# EasyEDA Pro project MasterSword_v1-0.eprj

# Schematic Schematic1
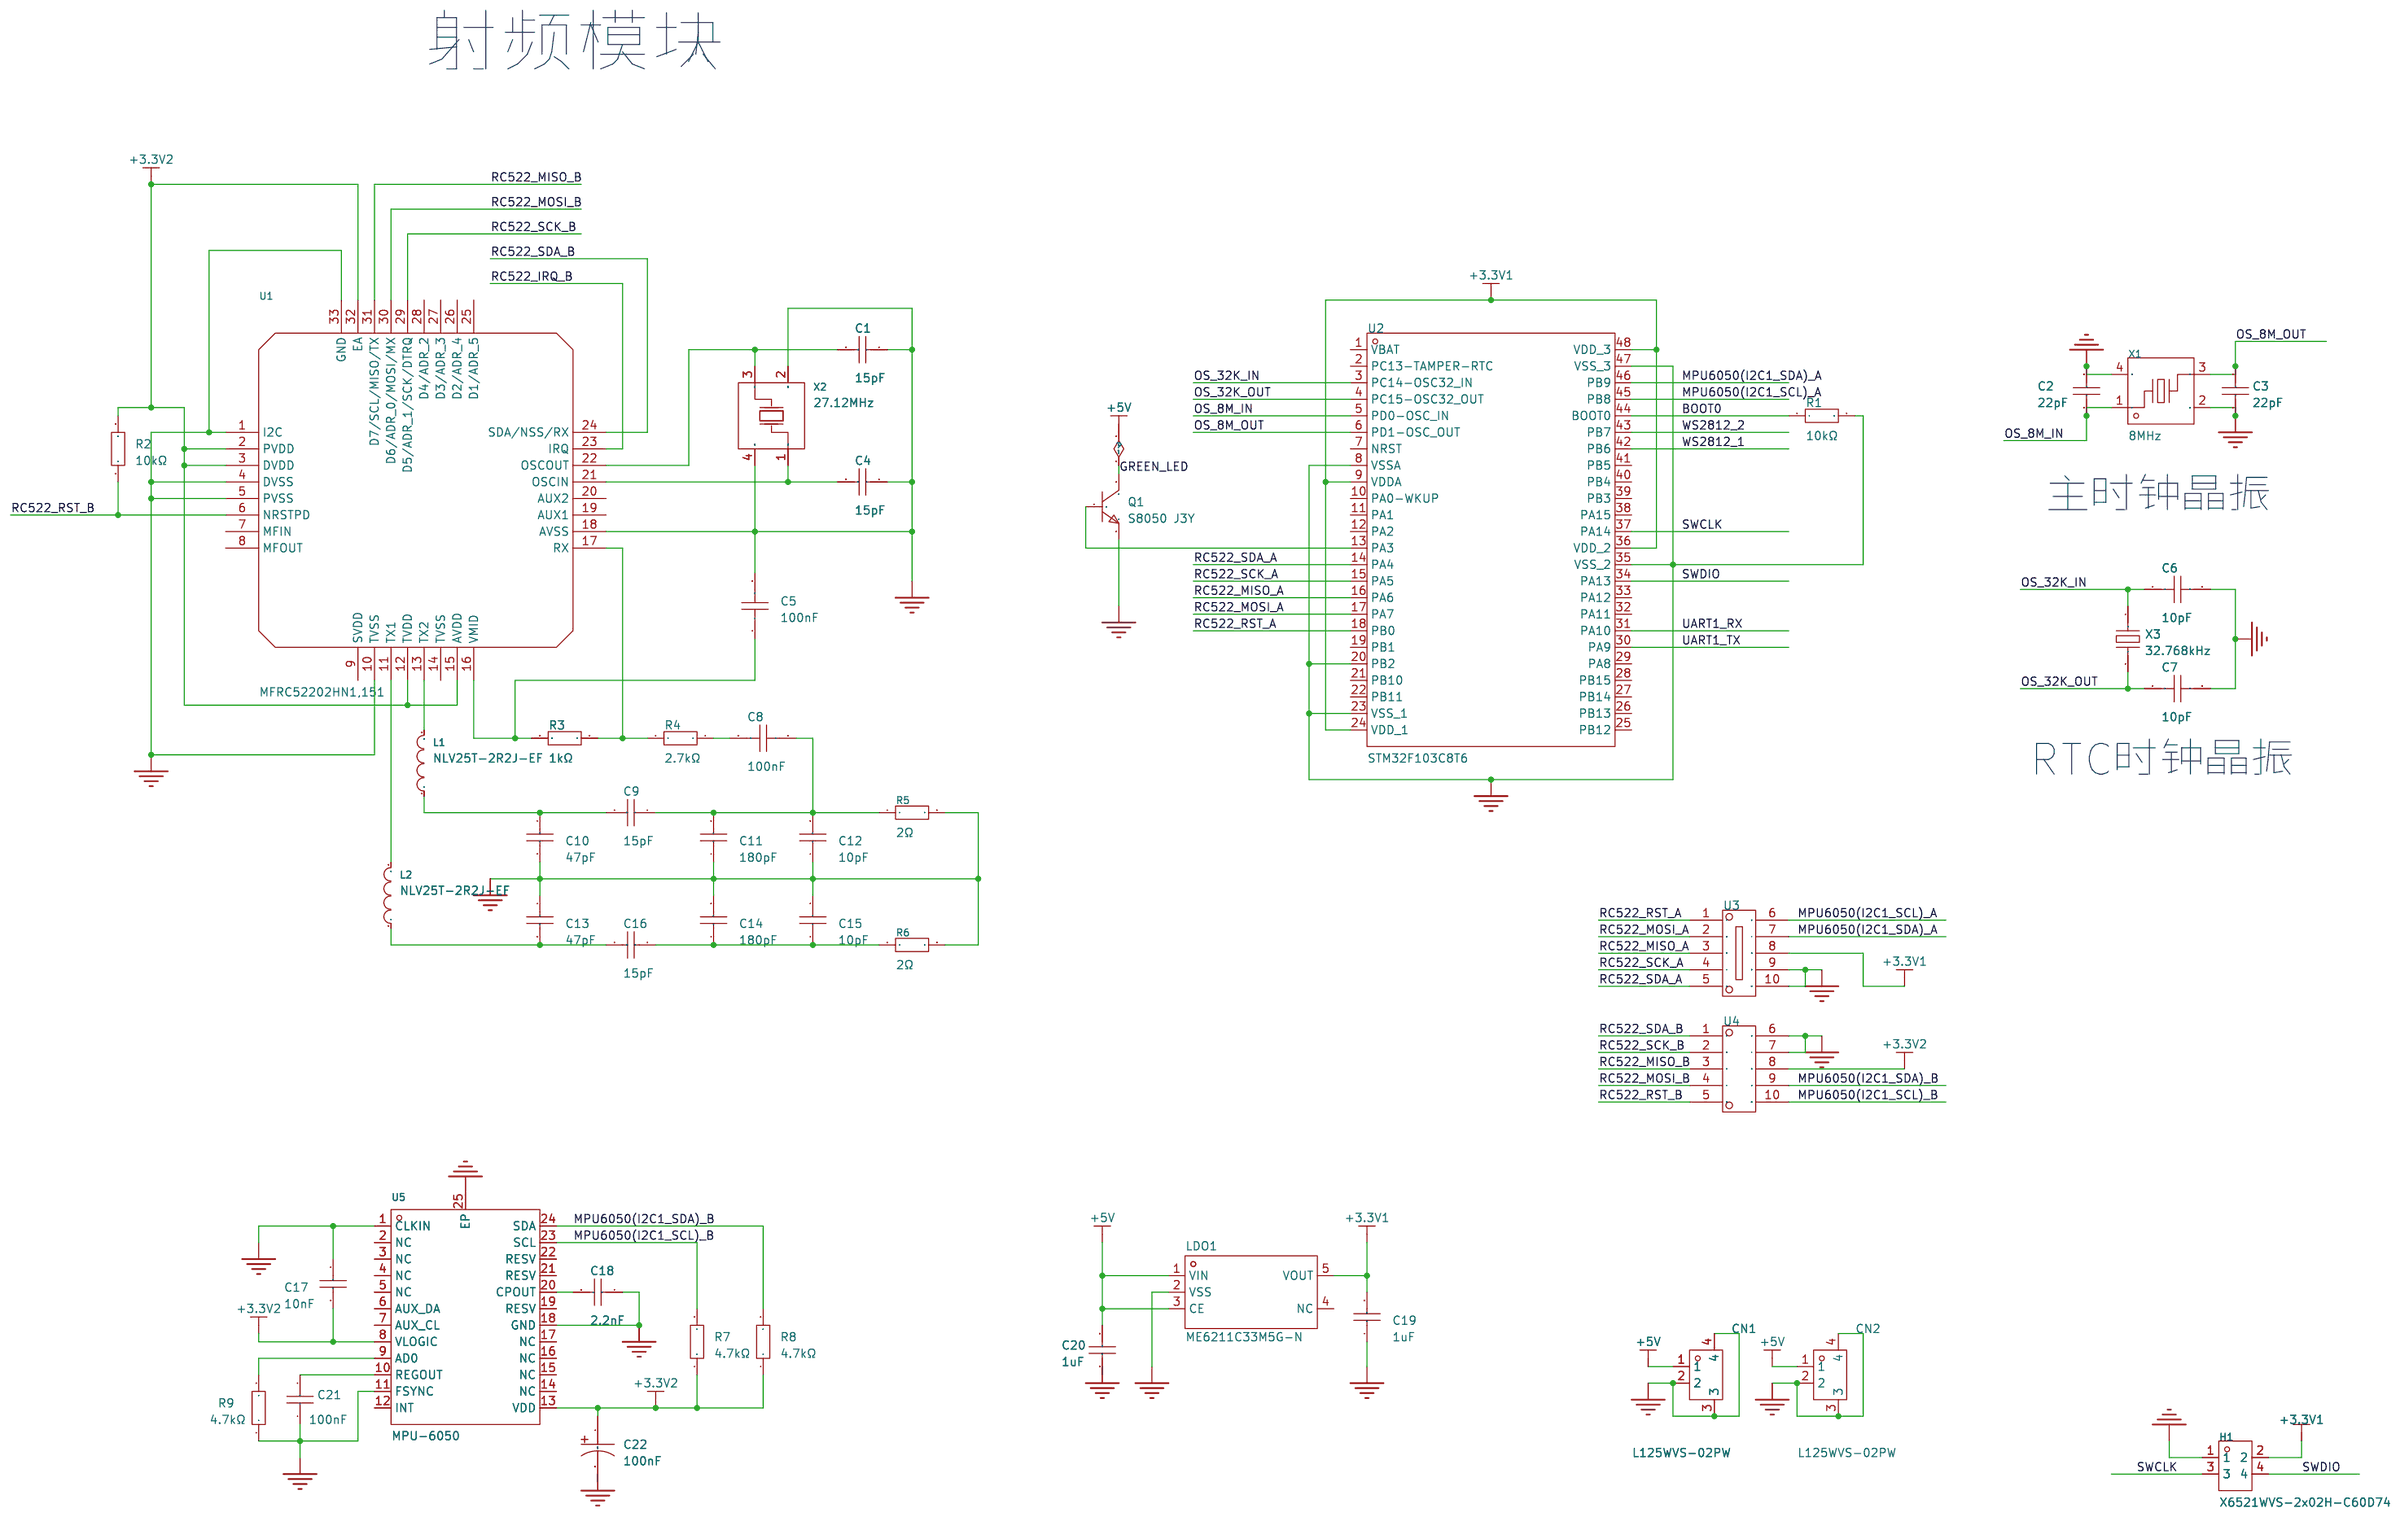
[diagram p0: schematic sheet]

## Parts
C1  15pF  [C0603]
C2  22pF  [C0603]
C3  22pF  [C0603]
C4  15pF  [C0603]
C5  100nF  [C0603]
C6  10pF  [C0603]
C7  10pF  [C0603]
C8  100nF  [C0603]
C9  15pF  [C0603]
C10  47pF  [C0603]
C11  180pF  [C0603]
C12  10pF  [C0603]
C13  47pF  [C0603]
C14  180pF  [C0603]
C15  10pF  [C0603]
C16  15pF  [C0603]
C17  10nF  [C0603]
C18  2.2nF  [C0603]
C19  1uF  [C0603]
C20  1uF  [C0603]
C21  100nF  [C0603]
C22  100nF  [CASE-A_3216]
CN1  L125WVS-02PW  [CONN-SMD_2P-P1.25_DELON_L125WVS-02PW]
CN2  L125WVS-02PW  [CONN-SMD_2P-P1.25_DELON_L125WVS-02PW]
H1  X6521WVS-2x02H-C60D74  [HDR-SMD_4P-P2.54-V-M-R2-C5-S7.4]
L1  NLV25T-2R2J-EF  [IND-SMD_L2.5-W2.0_NLV25T-390J-PF]
L2  NLV25T-2R2J-EF  [IND-SMD_L2.5-W2.0_NLV25T-390J-PF]
LDO1  ME6211C33M5G-N  [SOT-23-5_L3.0-W1.7-P0.95-LS2.8-BL]
Q1  S8050 J3Y  [SOT-23-3_L3.0-W1.7-P0.95-LS2.9-BR]
R1  10kΩ  [R0603]
R2  10kΩ  [R0603]
R3  1kΩ  [R0603]
R4  2.7kΩ  [R0603]
R5  2Ω  [R0603]
R6  2Ω  [R0603]
R7  4.7kΩ  [R0603]
R8  4.7kΩ  [R0603]
R9  4.7kΩ  [R0603]
U1  MFRC52202HN1,151  [QFN-32_L5.0-W5.0-P0.50-BL-EP3.4]
U2  STM32F103C8T6  [LQFP-48_L7.0-W7.0-P0.50-LS9.0-BL]
U3  -  [板对板双槽连接-母-10P]
U4  -  [板对板双槽连接-公-10P]
U5  MPU-6050  [QFN-24_L4.0-W4.0-P0.50-BL-EP2.7]
X1  8MHz  [OSC-SMD_4P-L3.2-W2.5-BL]
X2  27.12MHz  [CRYSTAL-SMD_4P-L3.2-W2.5-BL]
X3  32.768kHz  [OSC-SMD_L3.2-W1.5]

## Library data of the parts
C1 C4 C9 C16 = CC0603JRNPO9BN150: 容值:15pF;精度:±5%;额定电压:50V;材质(温度系数):NP0;; LCSC Part Name: 15pF ±5% 50V; Supplier Part: C107037; Manufacturer: YAGEO(国巨); Supplier Footprint: 0603; JLCPCB Part Class: 扩展库; Datasheet: https://atta.szlcsc.com/upload/public/pdf/source/20170420/1492670688140.pdf; Supplier: LCSC; Tolerance: ±5%; Voltage Rated: 50V; Temperature Coefficient: NP0
C2 C3 = CL10C220JB8NNNC: 容值:22pF;精度:±5%;额定电压:50V;材质(温度系数):C0G;; LCSC Part Name: 22pF ±5% 50V; Supplier Part: C1653; Manufacturer: SAMSUNG(三星); Supplier Footprint: 0603; JLCPCB Part Class: 基础库; Datasheet: https://atta.szlcsc.com/upload/public/pdf/source/20160103/1457707687317.pdf; Supplier: LCSC; Tolerance: ±5%; Voltage Rated: 50V; Temperature Coefficient: C0G
C5 C8 = CC0603KRX7R9BB104: 容值:100nF;精度:±10%;额定电压:50V;材质(温度系数):X7R;; LCSC Part Name: 100nF ±10% 50V; Supplier Part: C14663; Manufacturer: YAGEO(国巨); Supplier Footprint: 0603; JLCPCB Part Class: 基础库; Datasheet: https://atta.szlcsc.com/upload/public/pdf/source/20180910/C282072_33301C7F631E79921B82A8DAC6BCC5B3.pdf; Supplier: LCSC; Tolerance: ±10%; Voltage Rated: 50V; Temperature Coefficient: X7R
C6 C7 = 0603CG100J500NT: 容值:10pF;精度:±5%;额定电压:50V;材质(温度系数):C0G;; LCSC Part Name: 10pF ±5% 50V; Supplier Part: C91367; Manufacturer: FH(风华); Supplier Footprint: 0603; JLCPCB Part Class: 扩展库; Datasheet: https://atta.szlcsc.com/upload/public/pdf/source/20170923/C91367_1506149565935988975.pdf; Supplier: LCSC; Tolerance: ±5%; Voltage Rated: 50V; Temperature Coefficient: C0G
C10 C13 = CC0603JRNPO9BN470: 容值:47pF;精度:±5%;额定电压:50V;材质(温度系数):NP0;; LCSC Part Name: 47pF ±5% 50V; Supplier Part: C105622; Manufacturer: YAGEO(国巨); Supplier Footprint: 0603; JLCPCB Part Class: 扩展库; Datasheet: https://atta.szlcsc.com/upload/public/pdf/source/20170425/1493115772416.pdf; Supplier: LCSC; Tolerance: ±5%; Voltage Rated: 50V; Temperature Coefficient: NP0
C11 C14 = CC0603JRNPO9BN181: 容值:180pF;精度:±5%;额定电压:50V;材质(温度系数):NP0;; LCSC Part Name: 180pF ±5% 50V; Supplier Part: C107041; Manufacturer: YAGEO(国巨); Supplier Footprint: 0603; JLCPCB Part Class: 扩展库; Datasheet: https://atta.szlcsc.com/upload/public/pdf/source/20170420/1492670690406.pdf; Supplier: LCSC; Tolerance: ±5%; Voltage Rated: 50V; Temperature Coefficient: NP0
C12 C15 = CC0603JRNPO9BN100: 容值:10pF;精度:±5%;额定电压:50V;材质(温度系数):NP0;; LCSC Part Name: 10pF ±5% 50V; Supplier Part: C106245; Manufacturer: YAGEO(国巨); Supplier Footprint: 0603; JLCPCB Part Class: 扩展库; Datasheet: https://atta.szlcsc.com/upload/public/pdf/source/20170505/1493957837406.pdf; Supplier: LCSC; Tolerance: ±5%; Voltage Rated: 50V; Temperature Coefficient: NP0
C17 = CC0603KRX7R9BB103: 容值:10nF;精度:±10%;额定电压:50V;材质(温度系数):X7R;; LCSC Part Name: 10nF ±10% 50V; Supplier Part: C100042; Manufacturer: YAGEO(国巨); Supplier Footprint: 0603; JLCPCB Part Class: Extended Part; Datasheet: https://atta.szlcsc.com/upload/public/pdf/source/20180326/C100042_E8B0111D51DE3671A0A4A59FBCEFE81C.pdf; Supplier: LCSC; Tolerance: ±10%; Voltage Rated: 50V; Temperature Coefficient: X7R
C18 = 0603B222K500NT: 温度系数:X7R;容值:2.2nF;精度:±10%;额定电压:50V;; LCSC Part Name: 2.2nF(222) ±10% 50V; Supplier Part: C1604; Manufacturer: FH(风华); Supplier Footprint: 0603; JLCPCB Part Class: Basic Part; Datasheet: https://atta.szlcsc.com/upload/public/pdf/source/20170923/C1604_1506149289438988405.pdf; Supplier: LCSC; Temperature Coefficient: X7R; Tolerance: ±10%; Voltage Rated: 50V
C19 C20 = 0603B105K250NT: 容值:1uF;精度:±10%;额定电压:25V;材质(温度系数):X7R;; LCSC Part Name: 1uF ±10% 25V; Supplier Part: C59302; Manufacturer: FH(风华); Supplier Footprint: 0603; JLCPCB Part Class: 扩展库; Datasheet: https://atta.szlcsc.com/upload/public/pdf/source/20170923/C59302_1506149498957988854.pdf; Supplier: LCSC; Tolerance: ±10%; Voltage Rated: 25V; Temperature Coefficient: X7R
C21 = 0603B104K500NT: 容值:100nF;精度:±10%;额定电压:50V;材质(温度系数):X7R;; LCSC Part Name: 100nF ±10% 50V; Supplier Part: C30926; Manufacturer: FH(风华); Supplier Footprint: 0603; JLCPCB Part Class: 扩展库; Datasheet: https://atta.szlcsc.com/upload/public/pdf/source/20170923/C30926_1506149436298988724.pdf; Supplier: LCSC; Tolerance: ±10%; Voltage Rated: 50V; Temperature Coefficient: X7R
C22 = T491A104K035AT: 容值:100nF;精度:±10%;额定电压:35V;等效串联电阻:20Ω@100kHz;工作温度:-55℃~+125℃;; LCSC Part Name: 100nF ±10% 35V; Supplier Part: C122257; Manufacturer: KEMET(基美); JLCPCB Part Class: Extended Part; Datasheet: https://atta.szlcsc.com/upload/public/pdf/source/20170719/C122257_1500457815021828480.pdf; Supplier: LCSC; Tolerance: ±10%; Rated Voltage: 35V; Equivalent Series Resistance(ESR): 20Ω@100kHz; Operating Temperature: -55℃~+125℃
CN1 CN2 = L125WVS-02PW: 插针结构:1x2P;间距:1.25mm;安装方式:卧贴;总PIN数:2P;排数:1;每排PIN数:2;额定电流:1A;工作温度范围:-40℃~+110℃;; LCSC Part Name: 1x2P 间距:1.25mm 卧贴 GH1.25间距卧式贴片 2P 连接器; Supplier Part: C2998790; Manufacturer: DEALON(德艺隆); Supplier Footprint: SMD,P=1.25mm,卧贴; JLCPCB Part Class: 扩展库; Datasheet: https://atta.szlcsc.com/upload/public/pdf/source/20220425/50B09E6409C3A2782C6D65104D18E34A.pdf; Supplier: LCSC; Pins Structure: 1x2P; Pitch: 1.25mm; Mounting Style: 卧贴; Number of Pins: 2P; Number of Rows: 1; Number of PINs Per Row: 2; Current Rating (Max): 1A; Operating Temperature Range: -40℃~+110℃
H1 = X6521WVS-2x02H-C60D74: 间距:2.54mm;总PIN位数:4;排数:2;插针结构:2x2P;行距:2.54mm;安装类型:立贴;圆针/方针:方针;额定电流:3A;额定电压:250V;配合针长度:6mm;塑高:2.5mm;端接针长度:-;触头材质:黄铜;触头镀层:金;工作温度范围:-40℃~+105℃;焊接温度(最大值):260℃;颜色:黑色;; LCSC Part Name: 2.54mm 2x2P; Supplier Part: C780055; Manufacturer: XKB Connectivity(中国星坤); Supplier Footprint: SMD,P=2.54mm; JLCPCB Part Class: 扩展库; Supplier: LCSC; Pitch: 2.54mm; Number of Pins: 4; Number of Rows: 2; Pin Structure: 2x2P; Row Spacing: 2.54mm; Mounting Type: 立贴; Circluar Pins/Square Pins: 方针; Current Rating (Max): 3A; Voltage Rating (Max): 250V; Length of Mating Pin: 6mm; Insulation Height: 2.5mm; Contact Material: 黄铜; Contact Plating: 金; Operating Temperature Range: -40℃~+105℃; Welding Temperature (Max): 260℃; Color: 黑色
L1 L2 = NLV25T-2R2J-EF: LCSC Part Name: 2.2uH ±5%; Supplier Part: C286744; Manufacturer: TDK; Supplier Footprint: 1008; JLCPCB Part Class: 扩展库; Datasheet: https://atta.szlcsc.com/upload/public/pdf/source/20181106/C295188_2AED5BF284B1398395DA5D724136EAB4.pdf; Supplier: LCSC
LDO1 = ME6211C33M5G-N: 输出类型:固定;输出极性:正;最大输入电压:6V;输出电压:3.3V;输出电流:500mA;电源纹波抑制比(PSRR):70dB;; Supplier Part: C82942; Manufacturer: MICRONE(南京微盟); Supplier Footprint: SOT-23-5; JLCPCB Part Class: 扩展库; Datasheet: https://atta.szlcsc.com/upload/public/pdf/source/20170918/C82942_1505727073070976520.pdf; Supplier: LCSC; Output Type: 固定; Output Polarity: 正; Number of Outputs: 1; Maximum Input Voltage: 6V; Output Voltage: 3.3V; Dropout Voltage: 260mV@(200mA); Output Current: 500mA; Power Supply Rejection Ratio (PSRR): 70dB
Q1 = S8050 J3Y_C2146: 晶体管类型:NPN;集电极电流(Ic):500mA;集射极击穿电压(Vceo):25V;功率(Pd):300mW;直流电流增益(hFE@Ic,Vce):200@50mA,1V;; LCSC Part Name: NPN 电流:500mA 耐压:25V H档(200-350); Supplier Part: C2146; Manufacturer: CJ(江苏长电/长晶); Supplier Footprint: SOT-23; JLCPCB Part Class: 基础库; Datasheet: https://atta.szlcsc.com/upload/public/pdf/source/20140809/1457707209234.pdf; Supplier: LCSC; Transistor Type: NPN; Collector Current (Ic): 500mA; Collector-Emitter Breakdown Voltage (Vceo): 25V; Power Dissipation (Pd): 300mW; DC Current Gain (hFE@Ic,Vce): 200@50mA,1V; Transition Frequency (fT): 150MHz; Collector Cut-Off Current (Icbo): 100nA; Collector-Emitter Saturation Voltage (VCE(sat)@Ic,Ib): 600mV@500mA,50mA
R1 R2 = 0603WAF1002T5E: 电阻类型:厚膜电阻;阻值:10kΩ;精度:±1%;功率:100mW;; LCSC Part Name: 厚膜电阻 10kΩ ±1% 100mW; Supplier Part: C25804; Manufacturer: UNI-ROYAL(厚声); Supplier Footprint: 0603; JLCPCB Part Class: 基础库; Datasheet: https://atta.szlcsc.com/upload/public/pdf/source/20200306/C422600_1E6D84923E4A46A82E41ADD87F860B5C.pdf; Supplier: LCSC; Type: 厚膜电阻; Tolerance: ±1%; Power(Watts): 100mW; Temperature Coefficient: ±100ppm/℃; Overload Voltage (Max): 75V; Operating Temperature Range: -55℃~+155℃
R3 = 0603WAF1001T5E: 电阻类型:厚膜电阻;阻值:1kΩ;精度:±1%;功率:100mW;温度系数:±100ppm/℃;; LCSC Part Name: 厚膜电阻 1kΩ ±1% 100mW; Supplier Part: C21190; Manufacturer: UNI-ROYAL(厚声); Supplier Footprint: 0603; JLCPCB Part Class: Basic Part; Datasheet: https://atta.szlcsc.com/upload/public/pdf/source/20200306/C422600_1E6D84923E4A46A82E41ADD87F860B5C.pdf; Supplier: LCSC; Type: 厚膜电阻; Tolerance: ±1%; Power(Watts): 100mW; Temperature Coefficient: ±100ppm/℃; Overload Voltage (Max): 75V; Operating Temperature Range: -55℃~+155℃
R4 = 0603WAF2701T5E: 电阻类型:厚膜电阻;阻值:2.7kΩ;精度:±1%;功率:100mW;; LCSC Part Name: 2.7kΩ ±1% 100mW; Supplier Part: C13167; Manufacturer: UNI-ROYAL(厚声); Supplier Footprint: 0603; JLCPCB Part Class: Basic Part; Datasheet: https://atta.szlcsc.com/upload/public/pdf/source/20200306/C422600_1E6D84923E4A46A82E41ADD87F860B5C.pdf; Supplier: LCSC; Type: 厚膜电阻; Tolerance: ±1%; Power(Watts): 100mW; Temperature Coefficient: ±100ppm/℃; Overload Voltage (Max): 75V; Operating Temperature Range: -55℃~+155℃
R5 R6 = 0603WAF200KT5E: 电阻类型:厚膜电阻;阻值:2Ω;精度:±1%;功率:100mW;温度系数:±200ppm/℃;; LCSC Part Name: 厚膜电阻 2Ω ±1% 100mW; Supplier Part: C22977; Manufacturer: UNI-ROYAL(厚声); Supplier Footprint: 0603; JLCPCB Part Class: Basic Part; Datasheet: https://atta.szlcsc.com/upload/public/pdf/source/20200306/C422600_1E6D84923E4A46A82E41ADD87F860B5C.pdf; Supplier: LCSC; Type: 厚膜电阻; Tolerance: ±1%; Power(Watts): 100mW; Temperature Coefficient: ±200ppm/℃; Overload Voltage (Max): 75V; Operating Temperature Range: -55℃~+155℃
R7-R9 = 0603WAF4701T5E: 电阻类型:厚膜电阻;阻值:4.7kΩ;精度:±1%;功率:100mW;; LCSC Part Name: 4.7kΩ ±1% 100mW; Supplier Part: C23162; Manufacturer: UNI-ROYAL(厚声); Supplier Footprint: 0603; JLCPCB Part Class: 基础库; Datasheet: https://atta.szlcsc.com/upload/public/pdf/source/20200306/C422600_1E6D84923E4A46A82E41ADD87F860B5C.pdf; Supplier: LCSC; Type: 厚膜电阻; Tolerance: ±1%; Power(Watts): 100mW; Temperature Coefficient: ±100ppm/℃; Overload Voltage (Max): 75V; Operating Temperature Range: -55℃~+155℃
U1 = MFRC52202HN1,151: LCSC Part Name: 高度集成读写IC 用于13.56MHz非接触通信; Supplier Part: C11322; Manufacturer: NXP(恩智浦); Supplier Footprint: QFN-32-EP(5x5); JLCPCB Part Class: Extended Part; Datasheet: https://atta.szlcsc.com/upload/public/pdf/source/20140614/1457707090267.pdf; Supplier: LCSC
U2 = STM32F103C8T6: CPU内核:ARM Cortex-M3;CPU最大主频:72MHz;工作电压范围:2V~3.6V;程序存储容量:64KB;程序存储器类型:FLASH;RAM总容量:20KB;GPIO端口数量:37;; LCSC Part Name: STM32F103C8T6 MSL=3; Supplier Part: C8734; Manufacturer: ST(意法半导体); Supplier Footprint: LQFP-48(7x7); JLCPCB Part Class: 扩展库; Datasheet: https://atta.szlcsc.com/upload/public/pdf/source/20220812/8363ACEC51AD55ECEB84799464F7CB85.pdf; Supplier: LCSC; CPU Core: ARM Cortex-M3; CPU Maximum Speed: 72MHz; Operating Voltage Range: 2V~3.6V; Program Storage Size: 64KB; Program Memory Type: FLASH; RAM Size: 20KB; GPIO Ports Number: 37; ADC (Bit): 12bit; Universal Serial Bus: 有; Peripheral/Function: 看门狗；DMA；看门狗；片载温度传感器; Watchdog: 有; Infrared Data Association: 有; Low-Voltage Detect: 有; Direct Memory Access: 有; Internal Oscillator: 有; Operating Temperature Range: -40℃~+85℃
U3 = 板对板双槽连接-母-10P
U4 = 板对板双槽连接-公-10P
U5 = MPU-6050: 三轴加速度计和三轴陀螺仪，工作电压：2.375V~3.46V; Supplier Part: C24112; Manufacturer: TDK InvenSense(应美盛); Supplier Footprint: QFN-24(4x4); JLCPCB Part Class: 扩展库; Datasheet: https://atta.szlcsc.com/upload/public/pdf/source/20140425/1457707046159.pdf; Supplier: LCSC
X1 = X32258MOB4SI: 频率:8MHz;频率公差:±10ppm;负载电容:12pF;; LCSC Part Name: 8MHz ±10ppm 12pF YSX321SL; Supplier Part: C2682775; Manufacturer: YXC(扬兴晶振); Supplier Footprint: SMD3225-4P; JLCPCB Part Class: 扩展库; Datasheet: https://atta.szlcsc.com/upload/public/pdf/source/20210106/C2682774_0CD4FDA5D9DA3FBEEC23BD607A48E4B0.pdf; Supplier: LCSC; Crystal Type: 贴片无源晶振; Frequency Tolerance: ±10ppm; Frequency Stability: ±30ppm; Load Capacitance: 12pF; Equivalent Series Resistance (ESR): 150Ω; Operating Temperature: -40℃~+85℃
X2 = X32252712MSB4SI: 频率:27.12MHz;频率公差:±10ppm;负载电容:20pF;; LCSC Part Name: 27.12MHz ±10ppm 20pF YSX321SL; Supplier Part: C70591; Manufacturer: YXC(扬兴晶振); Supplier Footprint: SMD3225-4P; JLCPCB Part Class: Extended Part; Datasheet: https://atta.szlcsc.com/upload/public/pdf/source/20210329/C112971_1F611BDC486E193C1706F6D8EB5AA189.pdf; Supplier: LCSC; Crystal Type: 贴片无源晶振; Frequency Tolerance: ±10ppm; Frequency Stability: ±30ppm; Load Capacitance: 20pF; Operating Temperature: -40℃~+85℃
X3 = X321532768KGD2SI: 频率:32.768kHz;频率公差:±20ppm;负载电容:12.5pF;; LCSC Part Name: 32.768kHz ±20ppm 12.5pF YST310S; Supplier Part: C620155; Manufacturer: YXC(扬兴晶振); Supplier Footprint: SMD3215-2P; JLCPCB Part Class: 扩展库; Datasheet: https://atta.szlcsc.com/upload/public/pdf/source/20210329/C620155_E5A74FC0D27C5E9015A8D75DE9484FEA.pdf; Supplier: LCSC; Crystal Type: 贴片无源晶振; Frequency Tolerance: ±20ppm; Load Capacitance: 12.5pF; Operating Temperature: -40℃~+85℃

## Nets
+3.3V1: C19.2 H1.2 LDO1.5(VOUT) U2.9(VDDA) U2.24(VDD_1) U2.36(VDD_2) U2.48(VDD_3) U3.8
+3.3V2: C17.1 C22.1 R2.2 R7.1 R8.1 U1.2(PVDD) U1.3(DVDD) U1.12(TVDD) U1.15(AVDD) U1.32(EA) U4.8 U5.8(VLOGIC) U5.13(VDD)
+5V: C20.2 CN1.1 CN2.1 LDO1.1(VIN) LDO1.3(CE) Q1.3(C)
GND1: C2.2 C3.1 C6.2 C7.2 C19.1 C20.1 CN1.2 CN1.3 CN1.4 CN2.2 CN2.3 CN2.4 H1.1 LDO1.2(VSS) Q1.2(E) R1.2 U2.8(VSSA) U2.20(PB2) U2.23(VSS_1) U2.35(VSS_2) U2.47(VSS_3) U3.9 U3.10 X1.2(GND) X1.4(GND)
GND2: C1.1 C4.1 C5.2 C10.2 C11.1 C12.1 C13.1 C14.2 C15.2 C17.2 C18.1 C21.1 C22.2 R5.2 R6.2 R9.1 U1.1(I2C) U1.4(DVSS) U1.5(PVSS) U1.10(TVSS) U1.18(AVSS) U1.33(GND) U4.6 U4.7 U5.1(CLKIN) U5.11(FSYNC) U5.18(GND) U5.25(EP) X2.2(GND) X2.4(GND)
BOOT0: R1.1 U2.44(BOOT0)
MPU6050(I2C1_SCL)_A: U2.45(PB8) U3.6
MPU6050(I2C1_SCL)_B: R7.2 U4.10 U5.23(SCL)
MPU6050(I2C1_SDA)_A: U2.46(PB9) U3.7
MPU6050(I2C1_SDA)_B: R8.2 U4.9 U5.24(SDA)
OS_8M_IN: C2.1 U2.5(PD0-OSC_IN) X1.1
OS_8M_OUT: C3.2 U2.6(PD1-OSC_OUT) X1.3
OS_32K_IN: C6.1 U2.3(PC14-OSC32_IN) X3.2
OS_32K_OUT: C7.1 U2.4(PC15-OSC32_OUT) X3.1
RC522_IRQ_B: U1.23(IRQ)
RC522_MISO_A: U2.16(PA6) U3.3
RC522_MISO_B: U1.31(D7/SCL/MISO/TX) U4.3
RC522_MOSI_A: U2.17(PA7) U3.2
RC522_MOSI_B: U1.30(D6/ADR_0/MOSI/MX) U4.4
RC522_RST_A: U2.18(PB0) U3.1
RC522_RST_B: R2.1 U1.6(NRSTPD) U4.5
RC522_SCK_A: U2.15(PA5) U3.4
RC522_SCK_B: U1.29(D5/ADR_1/SCK/DTRQ) U4.2
RC522_SDA_A: U2.14(PA4) U3.5
RC522_SDA_B: U1.24(SDA/NSS/RX) U4.1
SWCLK: H1.3 U2.37(PA14)
SWDIO: H1.4 U2.34(PA13)
UART1_RX: U2.31(PA10)
UART1_TX: U2.30(PA9)
WS2812_1: U2.42(PB6)
WS2812_2: U2.43(PB7)
$1N1288: C1.2 U1.22(OSCOUT) X2.3(OSC2)
$1N1289: C4.2 U1.21(OSCIN) X2.1(OSC1)
$1N1291: R3.1 R4.2 U1.17(RX)
$1N1292: C5.1 R3.2 U1.16(VMID)
$1N1293: C8.2 R4.1
$1N1294: L1.2 U1.13(TX2)
$1N1295: L2.2 U1.11(TX1)
$1N1296: C9.2 C10.1 L1.1
$1N1297: C13.2 C16.2 L2.1
$1N1313: C14.1 C15.1 C16.1 R6.1
$1N1314: C8.1 C9.1 C11.2 C12.2 R5.1
$1N1748: C18.2 U5.20(CPOUT)
$1N1755: C21.2 U5.10(REGOUT)
$1N1757: R9.2 U5.9(AD0)
$1N5710: Q1.1(B) U2.13(PA3)

Not connected (* = marked no-connect by the designer): LDO1 4(NC); U1 7(MFIN) 8(MFOUT) 9(SVDD) 14(TVSS) 19(AUX1) 20(AUX2) 25(D1/ADR_5) 26(D2/ADR_4) 27(D3/ADR_3) 28(D4/ADR_2); U2 1(VBAT) 2(PC13-TAMPER-RTC) 7(NRST) 10(PA0-WKUP) 11(PA1) 12(PA2) 19(PB1) 21(PB10) 22(PB11) 25(PB12) 26(PB13) 27(PB14) 28(PB15) 29(PA8) 32(PA11) 33(PA12) 38(PA15) 39(PB3) 40(PB4) 41(PB5); U5 2(NC) 3(NC) 4(NC) 5(NC) 6(AUX_DA) 7(AUX_CL) 12(INT) 14(NC) 15(NC) 16(NC) 17(NC) 19(RESV) 21(RESV) 22(RESV)

## Notes on the sheet
- 射频模块
- 主时钟晶振
- RTC时钟晶振

# Board PCB1
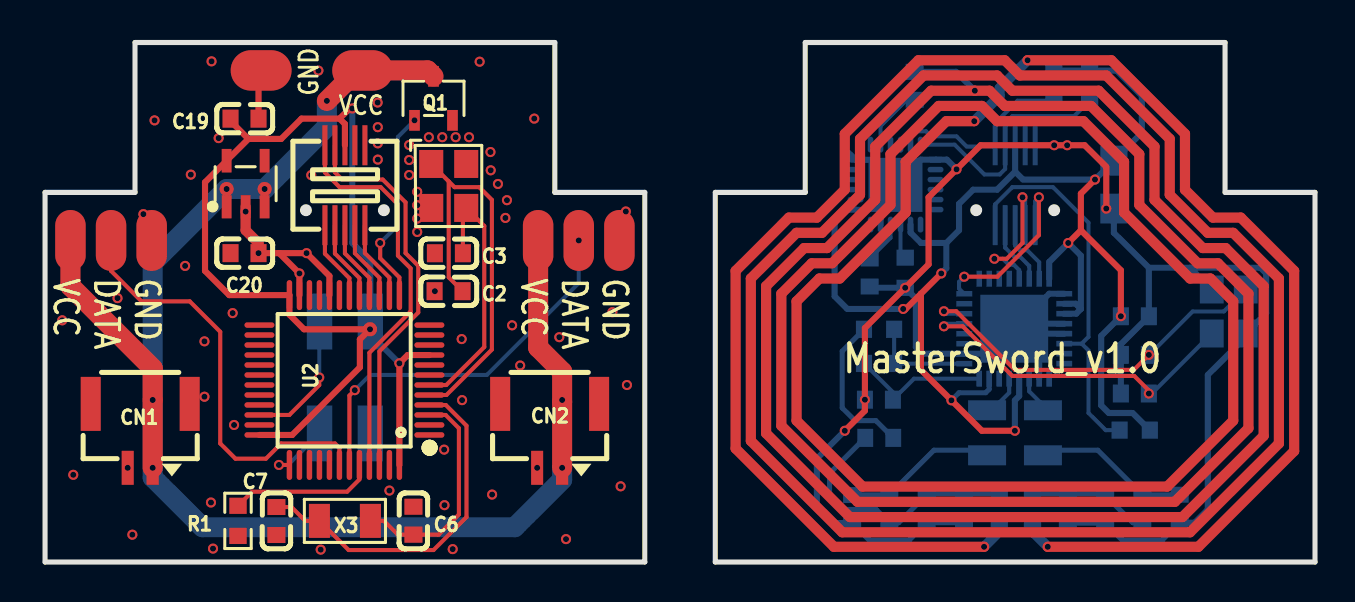
[diagram p1: board, top side]
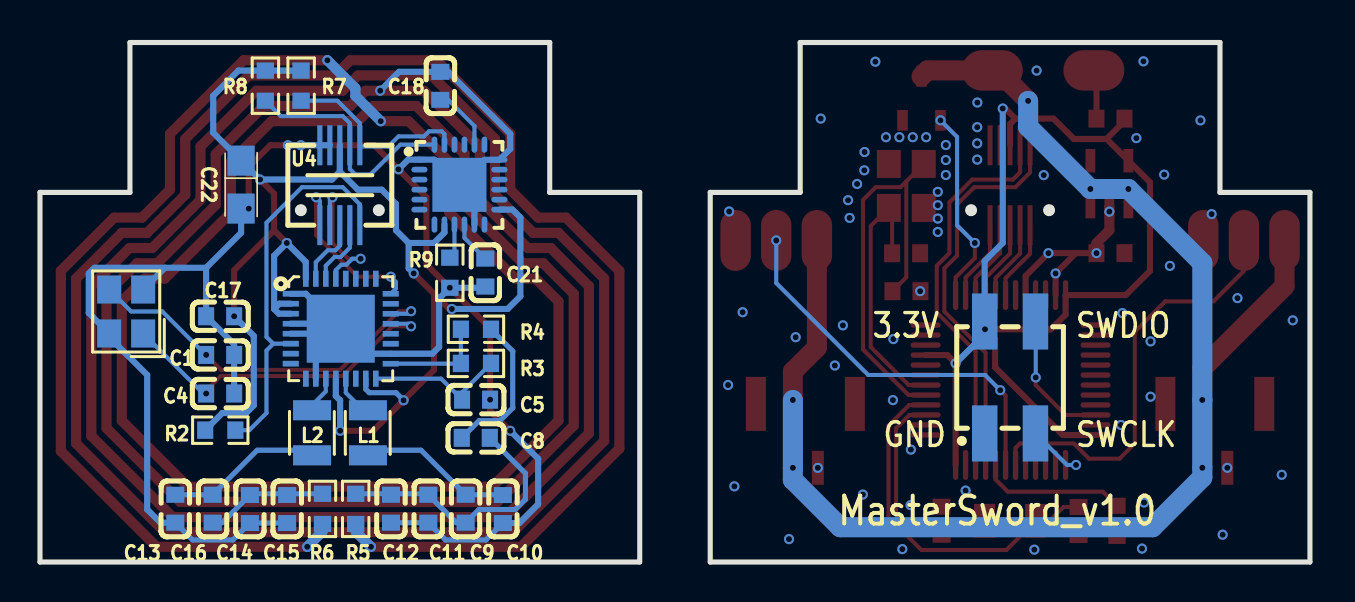
[diagram p2: board, bottom side, seen from below]

Outline 63.53 x 26 mm; copper layers: Top Layer, Bottom Layer. Coordinates in mm from the lower left corner of the outline.
Outline path: 0,18.5 4.5,18.5 4.5,26 25.5,26 25.5,18.5 30,18.5 30,0 0,0 0,18.5 ; 33.53,18.5 38.03,18.5 38.03,26 59.03,26 59.03,18.5 63.53,18.5 63.53,0 33.53,0 33.53,18.5
Stack: Top Layer 0.035mm / Dielectric1 1.51mm FR4 er 4.5 / Bottom Layer 0.035mm

## Design rules (mm)
template: 自定义配置
spacing copperThickness1oz (default): track to track 0.102, other pairs 0.152 to 0.3
spacing copperThickness2oz: track to track 0.203, other pairs 0.152 to 0.3
track width copperThickness1oz (default): min 0.127, default 0.254, max 2.54
track width copperThickness2oz: min 0.203, default 0.254, max 2.54
differential pair differentialPair (default): width min 0.127, default 0.254, max 2.54; gap min 0.152, default 0.152
via viaSize (default): diameter min 0.5, default 0.61, max 10; hole min 0.3, default 0.305, max 6.3

## Placement (name value [footprint] x y rotation side)
C1  15pF  [C0603]  54.52 10.37 0 bottom
C2  22pF  [C0603]  20.19 13.55 180 top
C3  22pF  [C0603]  20.2 15.45 0 top
C4  15pF  [C0603]  54.52 8.43 0 bottom
C5  100nF  [C0603]  41.71 8.12 180 bottom
C6  10pF  [C0603]  18.43 2.07 90 top
C7  10pF  [C0603]  11.57 2.05 270 top
C8  100nF  [C0603]  41.73 6.21 0 bottom
C9  15pF  [C0603]  42.24 2.67 90 bottom
C10  47pF  [C0603]  40.37 2.65 270 bottom
C11  180pF  [C0603]  44.1 2.67 90 bottom
C12  10pF  [C0603]  45.97 2.67 90 bottom
C13  47pF  [C0603]  56.76 2.67 90 bottom
C14  180pF  [C0603]  53.03 2.65 270 bottom
C15  10pF  [C0603]  51.16 2.65 270 bottom
C16  15pF  [C0603]  54.89 2.67 90 bottom
C17  10nF  [C0603]  54.52 12.3 0 bottom
C18  2.2nF  [C0603]  43.5 23.83 270 bottom
C19  1uF  [C0603]  9.98 22.19 180 top
C20  1uF  [C0603]  9.98 15.46 180 top
C21  100nF  [C0603]  41.25 14.49 90 bottom
C22  100nF  [CASE-A_3216]  53.47 18.89 270 bottom
CN1  L125WVS-02PW  [CONN-SMD_2P-P1.25_DELON_L125WVS-02PW]  4.76 6.31 180 top
CN2  L125WVS-02PW  [CONN-SMD_2P-P1.25_DELON_L125WVS-02PW]  25.24 6.31 180 top
H1  X6521WVS-2x02H-C60D74  [HDR-SMD_4P-P2.54-V-M-R2-C5-S7.4]  15 9.24 180 bottom
L1  NLV25T-2R2J-EF  [IND-SMD_L2.5-W2.0_NLV25T-390J-PF]  47.12 6.47 270 bottom
L2  NLV25T-2R2J-EF  [IND-SMD_L2.5-W2.0_NLV25T-390J-PF]  49.92 6.47 270 bottom
LDO1  ME6211C33M5G-N  [SOT-23-5_L3.0-W1.7-P0.95-LS2.8-BL]  10.03 18.93 0 top
NOREF  -  [Pad_e869]  3.3 16.09 0 top
NOREF#2  -  [Pad_e873]  24.67 16.09 0 top
NOREF#3  -  [Pad_e872]  1.27 16.09 0 top
NOREF#4  -  [Pad_e957]  15.89 24.6 90 top
NOREF#5  -  [Pad_e875]  26.7 16.09 0 top
NOREF#6  -  [Pad_e871]  5.33 16.09 0 top
NOREF#7  -  [Pad_e956]  10.81 24.6 90 top
NOREF#8  -  [Pad_e874]  28.73 16.09 0 top
Q1  S8050 J3Y  [SOT-23-3_L3.0-W1.7-P0.95-LS2.9-BR]  19.43 23.21 270 top
R1  10kΩ  [R0603]  9.65 2.06 270 top
R2  10kΩ  [R0603]  54.51 6.6 0 bottom
R3  1kΩ  [R0603]  41.72 9.94 180 bottom
R4  2.7kΩ  [R0603]  41.72 11.65 0 bottom
R5  2Ω  [R0603]  47.73 2.66 270 bottom
R6  2Ω  [R0603]  49.4 2.66 270 bottom
R7  4.7kΩ  [R0603]  50.47 23.84 270 bottom
R8  4.7kΩ  [R0603]  52.25 23.84 270 bottom
R9  4.7kΩ  [R0603]  43.03 14.48 90 bottom
U1  MFRC52202HN1,151  [QFN-32_L5.0-W5.0-P0.50-BL-EP3.4]  48.48 11.68 270 bottom
U2  STM32F103C8T6  [LQFP-48_L7.0-W7.0-P0.50-LS9.0-BL]  14.98 9.11 90 top
U3  -  [板对板双槽连接-母-10P]  14.98 18.83 0 top
U4  -  [板对板双槽连接-公-10P]  48.4 18.11 180 bottom
U5  MPU-6050  [QFN-24_L4.0-W4.0-P0.50-BL-EP2.7]  42.55 18.89 270 bottom
X1  8MHz  [OSC-SMD_4P-L3.2-W2.5-BL]  20.19 18.82 270 top
X2  27.12MHz  [CRYSTAL-SMD_4P-L3.2-W2.5-BL]  59.22 12.54 90 bottom
X3  32.768kHz  [OSC-SMD_L3.2-W1.5]  15 2.06 0 top

## Footprints (pads in the part's own frame, mm; a bottom-side part is the same pattern mirrored in y, then rotated)
C0603
  rect 0.8x0.9 smd: 1(-0.7,0) 2(0.7,0)
CASE-A_3216
  rect 1.5x1.359 smd: 1(-1.2,0) 2(1.2,0)
CONN-SMD_2P-P1.25_DELON_L125WVS-02PW
  rect 0.6x1.7 smd: 1(-0.625,1.6) 2(0.625,1.6)
  rect 1x2.7 smd: 3(2.475,-1.6) 4(-2.475,-1.6)
CRYSTAL-SMD_4P-L3.2-W2.5-BL
  rect 1.4x1.2 smd: 1(-1.1,-0.85) 2(1.1,-0.85) 3(1.1,0.85) 4(-1.1,0.85)
HDR-SMD_4P-P2.54-V-M-R2-C5-S7.4
  rect 1.27x2.8 smd: 1(-1.27,-2.8) 2(-1.27,2.8) 3(1.27,-2.8) 4(1.27,2.8)
IND-SMD_L2.5-W2.0_NLV25T-390J-PF
  rect 1x1.9 smd: 1(1.129,0) 2(-1.129,0)
LQFP-48_L7.0-W7.0-P0.50-LS9.0-BL
  oval 0.27x1.5 smd: 1(-2.75,-4.25) 2(-2.25,-4.25) 3(-1.75,-4.25) 4(-1.25,-4.25) 5(-0.75,-4.25) 6(-0.25,-4.25) 7(0.25,-4.25) 8(0.75,-4.25) 9(1.25,-4.25) 10(1.75,-4.25) 11(2.25,-4.25) 12(2.75,-4.25) 25(2.75,4.25) 26(2.25,4.25) 27(1.75,4.25) 28(1.25,4.25) 29(0.75,4.25) 30(0.25,4.25) 31(-0.25,4.25) 32(-0.75,4.25) 33(-1.25,4.25) 34(-1.75,4.25) 35(-2.25,4.25) 36(-2.75,4.25)
  oval 1.5x0.27 smd: 13(4.25,-2.75) 14(4.25,-2.25) 15(4.25,-1.75) 16(4.25,-1.25) 17(4.25,-0.75) 18(4.25,-0.25) 19(4.25,0.25) 20(4.25,0.75) 21(4.25,1.25) 22(4.25,1.75) 23(4.25,2.25) 24(4.25,2.75) 37(-4.25,2.75) 38(-4.25,2.25) 39(-4.25,1.75) 40(-4.25,1.25) 41(-4.25,0.75) 42(-4.25,0.25) 43(-4.25,-0.25) 44(-4.25,-0.75) 45(-4.25,-1.25) 46(-4.25,-1.75) 47(-4.25,-2.25) 48(-4.25,-2.75)
OSC-SMD_4P-L3.2-W2.5-BL
  rect 1.4x1.2 smd: 1(-1.1,-0.875) 2(1.1,-0.875) 3(1.1,0.875) 4(-1.1,0.875)
OSC-SMD_L3.2-W1.5
  rect 1.05x1.7 smd: 1(-1.275,0) 2(1.275,0)
Pad_e869
  oval 1.524x3.048 smd: 49(0,0)
Pad_e871
  oval 1.524x3.048 smd: 49(0,0)
Pad_e872
  oval 1.524x3.048 smd: 49(0,0)
Pad_e873
  oval 1.524x3.048 smd: 49(0,0)
Pad_e874
  oval 1.524x3.048 smd: 49(0,0)
Pad_e875
  oval 1.524x3.048 smd: 49(0,0)
Pad_e956
  oval 2.024x3.048 smd: 49(0,0)
Pad_e957
  oval 2.024x3.048 smd: 49(0,0)
QFN-24_L4.0-W4.0-P0.50-BL-EP2.7
  oval 0.28x0.8 smd: 1(-1.25,-2) 2(-0.75,-2) 3(-0.25,-2) 4(0.25,-2) 5(0.75,-2) 6(1.25,-2) 13(1.25,2) 14(0.75,2) 15(0.25,2) 16(-0.25,2) 17(-0.75,2) 18(-1.242,2)
  oval 0.8x0.28 smd: 7(2,-1.25) 8(2,-0.75) 9(2,-0.25) 10(2,0.25) 11(2,0.75) 12(2,1.25) 19(-2,1.25) 20(-2,0.75) 21(-2,0.25) 22(-2,-0.25) 23(-2,-0.75) 24(-2,-1.25)
  rect 2.7x2.7 smd: 25(0.013,0)
QFN-32_L5.0-W5.0-P0.50-BL-EP3.4
  rect 0.28x0.8 smd: 1(-1.75,-2.5) 2(-1.252,-2.5) 3(-0.751,-2.5) 4(-0.252,-2.5) 5(0.248,-2.5) 6(0.749,-2.5) 7(1.248,-2.5) 8(1.748,-2.5) 17(1.752,2.5) 18(1.252,2.5) 19(0.751,2.5) 20(0.252,2.5) 21(-0.248,2.5) 22(-0.749,2.5) 23(-1.248,2.5) 24(-1.748,2.5)
  rect 0.8x0.28 smd: 9(2.5,-1.748) 10(2.5,-1.248) 11(2.5,-0.748) 12(2.5,-0.248) 13(2.5,0.252) 14(2.5,0.752) 15(2.5,1.252) 16(2.5,1.752) 25(-2.5,1.75) 26(-2.5,1.25) 27(-2.5,0.75) 28(-2.5,0.25) 29(-2.5,-0.25) 30(-2.5,-0.75) 31(-2.5,-1.25) 32(-2.5,-1.75)
  rect 3.4x3.4 smd: 33(0,0)
R0603
  rect 0.806x0.864 smd: 1(-0.753,0) 2(0.753,0)
SOT-23-3_L3.0-W1.7-P0.95-LS2.9-BR
  rect 1.038x0.532 smd: 1(1.101,-0.95) 2(1.101,0.95) 3(-1.101,0)
SOT-23-5_L3.0-W1.7-P0.95-LS2.8-BL
  rect 0.49x1.157 smd: 1(-0.95,-1.153) 2(0,-1.153) 3(0.95,-1.153)
  rect 0.49x1.175 smd: 4(0.95,1.153) 5(-0.95,1.153)
板对板双槽连接-公-10P
  custom 0.25x2 smd: 1(-1.125,-1.25) 2(-0.625,-1.25) 3(-0.125,-1.25) 4(0.375,-1.25) 5(0.875,-1.25) 6(-1.125,2.75) 7(-0.625,2.75) 8(-0.125,2.75) 9(0.375,2.75) 10(0.875,2.75)
板对板双槽连接-母-10P
  custom 0.25x2 smd: 1(-0.982,-1.972) 2(-0.482,-1.972) 3(0.018,-1.972) 4(0.518,-1.972) 5(1.018,-1.972) 6(-0.982,2.028) 7(-0.482,2.028) 8(0.018,2.028) 9(0.518,2.028) 10(1.018,2.028)

## Nets
As in the schematic, except:
+5V: C20.2 CN1.1 CN2.1 LDO1.1 LDO1.3 NOREF#2.49 NOREF#3.49 NOREF#4.49 Q1.3
GND1: C2.2 C3.1 C6.2 C7.2 C19.1 C20.1 CN1.2 CN1.3 CN1.4 CN2.2 CN2.3 CN2.4 H1.1 LDO1.2 NOREF#6.49 NOREF#7.49 NOREF#8.49 Q1.2 R1.2 U2.8 U2.20 U2.23 U2.35 U2.47 U3.9 U3.10 X1.2 X1.4
WS2812_1: NOREF.49 U2.42
WS2812_2: NOREF#5.49 U2.43

Pads without a net: LDO1 4; U1 7 8 9 14 19 20 25 26 27 28; U2 1 2 7 10 11 12 19 21 22 25 26 27 28 29 32 33 38 39 40 41; U5 2 3 4 5 6 7 12 14 15 16 17 19 21 22

## Via types
v1: diameter 0.505, hole 0.305, Top Layer to Bottom Layer, 98 vias
v2: diameter 0.705, hole 0.305, Top Layer to Bottom Layer, 8 vias

## Routing (per net, layer and track width the routed paths; a pad name or vN(x,y) marks a point on that pad's centre or on a via; arc(x,y) is an arc through that point)
+3.3V1: length 55.2
  Top Layer w0.305: U2.48 v1(17.73,9.94) 18.14,10.36 U2.9 ; 14.73,22.19 15.24,22.7 v1(15.37,22.7) ; 14.73,22.19 12.83,22.19 11.81,21.17 10.17,21.17 ; 14.73,22.19 15,21.92 U3.8 ; U2.36 12.36,6.36 15.75,9.74 15.75,11.14 v2(16.26,11.65) 12.95,11.65 12.23,12.38 U2.24 9.21,13.36 8,14.57 8,19 10.17,21.17 ; 10.17,21.17 9.28,22.07 C19.2
  Bottom Layer w0.305: v1(17.73,9.94) 16.27,11.4 H1.2 16.27,15.06 15.37,15.97 v1(15.37,22.7)
+3.3V2: length 76.2
  Top Layer w0.305: v1(48.51,6.57) 46.86,6.57 v1(45.34,8.09) 43.82,9.62 43.82,13.43 ; 43.82,13.43 v1(44.83,14.44) ; 43.82,13.43 43.05,12.66 v1(42.93,12.66) ; 51.82,16.6 51.82,18.44 v1(52.52,19.14) ; 51.82,16.6 v1(51.18,15.97) ; 51.82,16.6 53.82,14.6 v1(53.82,12.3)
  Bottom Layer w0.254: 47.23,9.18 47.23,8.65 47.05,8.47 45.72,8.47 v1(45.34,8.09)
  Bottom Layer w0.305: U5.13 39.9,17.64 39.5,17.24 39.5,13.3 40.13,12.66 v1(42.93,12.66) ; 45.08,15.97 45.08,14.7 v1(44.83,14.44) ; 45.08,15.97 43.82,15.97 43.3,16.49 U5.8 ; 45.08,15.97 45.72,16.6 45.72,17.92 46.43,18.63 47.63,18.63 48.53,19.54 ; U1.3 51.58,12.43 51.82,12.66 ; 51.82,12.66 51.82,15.33 v1(51.18,15.97) 50.23,15.02 U1.32 ; 51.82,12.66 51.55,12.93 U1.2 ; U4.8 48.53,19.54 ; 48.53,19.54 48.92,19.14 v1(52.52,19.14) C22.1 54.86,21.48 54.86,23.33 53.6,24.59 R8.1 R7.1 ; R2.2 54.4,7.46 53.21,7.46 52.83,7.84 52.83,11.32 v1(53.82,12.3) ; U1.12 48.73,8.31 48.51,8.09 v1(48.51,6.57)
+5V: length 81.1
  Top Layer w1: Q1.3 19.14,24.6 NOREF#4.49 15.62,24.6 v2(14.1,23.08) ; v2(25.87,4.71) 25.87,9.53 24.67,10.73 NOREF#2.49 ; NOREF#3.49 1.27,13.81 5.38,9.69 v2(5.38,8.11) v2(5.38,4.71)
  Bottom Layer w1: v2(14.1,23.08) 14.1,21.78 v2(10.98,18.67) v2(9.08,18.67) 5.38,14.97 v2(5.38,8.11) v2(5.38,4.71) 5.38,4.23 7.87,1.74 23.49,1.74 25.87,4.11 v2(25.87,4.71) v2(25.87,8.11)
GND1: length 12.6
  Top Layer w0.305: 11.71,15.46 v1(12.73,14.44) U2.23 ; 11.71,15.46 v1(13.08,15.46) 14.23,14.31 U2.20 ; 11.71,15.46 v1(10.68,15.46) ; C19.1 10.68,24.47 NOREF#7.49
  Top Layer w0.508: LDO1.2 10.03,16.6 10.68,15.96 v1(10.68,15.46)
  vias: v1(0.86,12.1) v1(1.41,4.37) v1(3.62,13.21) v1(4.13,4.71) v1(4.37,1.37) v1(4.92,17.41) v1(5.48,22.1) v1(7.01,14.82) v1(7.29,19.39) v1(7.97,11.04) v1(7.97,8.27) v1(8.3,2.98) v1(8.33,25.06) v1(8.4,0.67) v1(8.68,21.21) v1(9.38,12.46) v1(9.45,6.86) v1(10.03,17.54) v1(13.32,19.36) v1(13.67,24.59) v1(13.79,0.62) v1(16.64,23) v1(16.64,21.76) v1(16.64,20.95) v1(16.64,20.14) v1(17.23,3.58) v1(18.21,20.87) v1(18.21,20.12) v1(18.21,19.37) v1(18.62,18.53) v1(18.62,17.86) v1(18.62,17.19) v1(18.62,16.52) v1(19.2,21.26) v1(19.5,13.55) v1(19.87,21.26) v1(19.96,5.63) v1(19.98,2.85) v1(20.39,0.65) v1(20.54,21.26) v1(20.84,11.16) v1(20.86,8.1) v1(21.21,21.26) v1(21.74,25.04) v1(22.28,20.52) v1(22.29,19.6) v1(22.36,3.38) v1(22.65,18.92) v1(23.11,18.11) v1(23.03,17.22) v1(23.36,11.85) v1(23.77,9.84) v1(24.47,22.19) v1(24.62,4.71) v1(25.73,11.25) v1(26.06,1.15) v1(28.38,12.5) v1(28.79,3.79) v1(29.05,17.54) v1(29.11,8.86)
GND2: length 518.4
  Top Layer w0.305: v1(53.09,17.69) 53.09,19.78 52,20.86 v1(51.13,20.86) v1(50.48,20.86) 46.8,20.86 v1(45.6,19.65) 44.2,18.25 44.2,14.89 v1(43.03,13.73) 41.01,11.71 v1(41.01,8.12) 41.01,7.58 v1(40.01,6.57)
  Top Layer w0.508: v1(50.16,0.76) 57.69,0.76 62.48,5.55 62.48,14.57 59.82,17.24 58.42,17.24 57.02,18.63 57.02,21.43 53.34,25.11 v1(49.15,25.11) ; v1(46.97,0.76) 39.46,0.76 34.54,5.68 34.54,14.57 37.21,17.24 38.61,17.24 40.01,18.63 40.01,21.43 43.69,25.11 48.01,25.11 48.77,24.35 53.09,24.35 56.26,21.17 56.26,18.38 58.17,16.47 59.44,16.47 61.72,14.19 61.72,5.93 57.28,1.49 39.88,1.49 35.31,6.06 35.31,14.19 37.59,16.47 38.86,16.47 40.77,18.38 40.77,21.17 43.94,24.35 47.63,24.35 48.39,23.59 52.7,23.59 55.5,20.79 55.5,18.13 57.91,15.71 59.05,15.71 60.96,13.81 60.96,6.31 56.9,2.25 40.26,2.25 36.07,6.44 36.07,13.81 37.97,15.71 39.12,15.71 41.53,18.13 41.53,20.79 44.32,23.59 v1(46.51,23.59) 47.24,23.59 48.01,22.82 52.32,22.82 54.74,20.41 54.74,17.87 57.66,14.95 58.67,14.95 60.2,13.43 60.2,6.7 56.52,3.01 40.64,3.01 36.83,6.82 36.83,13.43 38.35,14.95 39.37,14.95 42.29,17.87 42.29,20.41 44.7,22.82 46.86,22.82 47.63,22.06 51.94,22.06 53.98,20.03 53.98,17.49 57.28,14.19 58.29,14.19 59.44,13.05 59.44,7.08 56.13,3.77 40.89,3.77 37.59,7.08 37.59,13.05 38.73,14.19 39.75,14.19 43.05,17.49 43.05,20.03 45.08,22.06 v1(46.48,22.06)
  Bottom Layer w0.254: C15.2 C14.2 53.87,1.11 55.9,1.11 C13.1 ; C12.1 C11.1 43.24,1.11 41.22,1.11 C10.2
  Bottom Layer w0.305: 55.22,14.73 C17.2 53.82,10.9 C1.1 C4.1 ; 55.22,14.73 57.28,14.73 ; 55.22,14.73 53.47,16.47 C22.2 ; U5.25 41.8,18.13 U5.11 ; U5.25 41.29,20.13 U5.18 40.01,20.67 40.01,21.43 43.11,24.53 C18.1 45.57,24.53 v1(46.51,23.59) ; U5.25 43.81,20.14 U5.1 45.11,20.14 v1(45.6,19.65) ; C10.2 39.54,1.95 38.61,2.89 38.61,5.17 v1(40.01,6.57) ; U1.4 48.73,11.93 ; 48.73,11.93 50.23,13.43 U1.1 ; 48.73,11.93 U1.33 ; 48.73,11.43 U1.33 ; 48.73,11.43 49.73,10.43 U1.10 ; 48.73,11.43 U1.5 ; U1.33 47.23,10.42 43.9,10.42 43.56,10.76 43.56,13.19 v1(43.03,13.73) 41.31,13.73 C21.1 ; 57.28,14.73 58.36,13.64 ; 57.28,14.73 60.8,14.73 61.09,14.44 61.09,12.46 X2.4 60.07,11.26 58.17,9.36 58.17,2.63 57.5,1.97 C13.1 ; v1(51.13,20.86) v1(50.48,20.86) U4.6 U4.7
  Bottom Layer w0.508: v1(46.48,22.06) 47.75,23.33 47.75,23.71 v1(49.15,25.11) ; v1(50.16,0.76) 49.4,1.52 R6.2 ; v1(46.97,0.76) 47.73,1.52 R5.2
BOOT0: length 7.3
  Top Layer w0.203: U2.44 15.73,4.13 15.11,3.52 10.36,3.52 R1.1
MPU6050(I2C1_SCL)_A: length 19.8
  Top Layer w0.203: U2.45 16.23,10.47 18.29,12.54 18.29,14.7 17.65,15.33 17.65,17.9 16.79,18.76 14.73,18.76 14,19.49 U3.6
MPU6050(I2C1_SCL)_B: length 9.7
  Bottom Layer w0.203: U5.23 43.3,21.42 43.43,21.55 44.07,21.55 44.32,21.3 45.59,21.3 46.1,20.79 47.46,20.79 U4.10 47.53,21.97 48.65,23.09 R7.2
MPU6050(I2C1_SDA)_A: length 19.7
  Top Layer w0.203: U3.7 14.5,19.5 14.86,19.14 16.89,19.14 18.03,18 18.03,15.46 18.67,14.82 18.67,12.49 16.73,10.54 U2.46
MPU6050(I2C1_SDA)_B: length 11.9
  Bottom Layer w0.203: U5.24 45.5,20.89 46.99,19.4 47.75,19.4 48.03,19.67 U4.9 48.03,21.96 48.39,22.32 51.48,22.32 R8.2
OS_8M_IN: length 21.1
  Top Layer w0.203: 20.19,19.05 19.32,19.92 ; 20.19,19.05 20.48,18.76 21.72,18.76 22.35,18.13 22.35,10.63 20.08,8.36 U2.5 ; 20.19,19.05 20.19,14.25 C2.1
OS_8M_OUT: length 13.2
  Top Layer w0.203: C3.2 20.9,17.55 X1.3 21.97,16.82 21.97,10.76 20.07,8.86 U2.6
OS_32K_IN: length 11.2
  Top Layer w0.203: X3.2 16.95,2.06 17.65,1.37 C6.1 19.69,1.37 20.7,2.38 20.7,6.7 20.04,7.36 U2.3
OS_32K_OUT: length 17.9
  Top Layer w0.203: C7.1 12.33,2.75 13.02,2.06 X3.1 15.19,0.6 19.43,0.6 21.08,2.25 21.08,6.82 20.05,7.86 U2.4
RC522_MISO_A: length 4
  Top Layer w0.203: U3.3 15,15.44 16.23,14.22 U2.16
RC522_MISO_B: length 3.1
  Bottom Layer w0.203: U4.3 48.53,15.83 48.75,15.6 49.13,15.6 49.73,15 49.73,14.43
RC522_MOSI_A: length 4
  Top Layer w0.203: U3.2 14.5,15.44 15.73,14.21 U2.17
RC522_MOSI_B: length 3.1
  Bottom Layer w0.203: U4.4 48.03,15.73 48.49,15.27 48.79,15.27 49.23,14.82 49.23,14.43
RC522_RST_A: length 4
  Top Layer w0.203: U2.18 15.23,14.2 14,15.43 U3.1
RC522_RST_B: length 19.4
  Bottom Layer w0.203: 51.86,10.93 52.2,10.59 52.2,7.46 53.06,6.6 R2.1 ; 51.86,10.93 U1.6 ; 51.86,10.93 52.2,11.27 52.2,16.98 50.42,18.76 48.39,18.76 47.53,17.9 U4.5
RC522_SCK_A: length 4
  Top Layer w0.203: U2.15 16.73,14.23 15.5,15.45 U3.4
RC522_SCK_B: length 7.4
  Top Layer w0.203: v1(48.89,18.25) 48.89,15.97 48.11,15.18 v1(47.49,15.18)
  Bottom Layer w0.203: U4.2 49.03,18.12 v1(48.89,18.25) ; U1.29 48.73,14.61 48.46,14.88 48.2,14.88 47.91,15.18 v1(47.49,15.18)
RC522_SDA_A: length 4
  Top Layer w0.203: U2.14 17.23,14.24 16,15.46 U3.5
RC522_SDA_B: length 9
  Top Layer w0.203: v1(45.98,14.28) 47.64,14.28 49.72,16.36 v1(49.72,18.25)
  Bottom Layer w0.203: v1(49.72,18.25) 49.53,18.07 U4.1 ; v1(45.98,14.28) 45.72,14.02 45.72,13.69 45.98,13.42
SWCLK: length 3.2
  Top Layer w0.203: v1(11.7,4.86) U2.37
  Bottom Layer w0.203: v1(11.7,4.86) 12.15,4.86 H1.3
SWDIO: length 6.8
  Top Layer w0.203: U2.34 12.22,7.36 13.72,8.85 v1(13.72,9.24)
  Bottom Layer w0.203: v1(13.72,9.24) 13.72,12.02 H1.4
WS2812_1: length 21.4
  Top Layer w0.203: NOREF.49 3.3,14.57 4.83,13.05 7.24,13.05 8.76,11.52 8.76,5.93 9.53,5.17 11.05,5.17 11.81,5.93 14.5,5.93 14.73,5.71 U2.42
WS2812_2: length 19.4
  Top Layer w0.203: v1(15.49,8.6) 15.23,8.33 U2.43
  Bottom Layer w0.203: v1(26.7,16.09) 26.7,13.96 22.1,9.36 16.26,9.36 v1(15.49,8.6)
$1N1288: length 19
  Top Layer w0.203: v1(55.22,10.37) 54.47,9.62 48.51,9.62 45.58,12.55 v1(44.97,12.55)
  Bottom Layer w0.203: X2.3 58.97,12.54 57.4,12.54 55.23,10.37 v1(55.22,10.37) ; v1(44.97,12.55) 45.09,12.42 45.98,12.42
$1N1289: length 17.2
  Top Layer w0.203: v1(55.22,8.43) 55.22,8.58 54.49,9.31 48.39,9.31 45.9,11.8 v1(44.97,11.8)
  Bottom Layer w0.203: 45.98,11.92 45.09,11.92 v1(44.97,11.8) ; 58.36,11.44 55.36,8.43 v1(55.22,8.43)
$1N1291: length 5.2
  Bottom Layer w0.203: 45.98,9.92 42.49,9.92 R3.1 R4.2
$1N1292: length 7.2
  Bottom Layer w0.203: R3.2 42.41,8.49 C5.1 43.46,9.18 U1.16
$1N1293: length 7.6
  Bottom Layer w0.254: 40.97,11.65 39.88,10.55 39.88,7.71 40.51,7.08 41.56,7.08 42.42,6.21
$1N1294: length 2.1
  Bottom Layer w0.203: 48.23,9.18 48.23,8.47 47.61,7.85 47.12,7.85
$1N1295: length 1.9
  Bottom Layer w0.203: 49.92,7.85 49.23,8.54 49.23,9.43
$1N1296: length 7.7
  Bottom Layer w0.254: C10.1 40.39,3.37 C9.2 44.46,5.59 47.12,5.59
$1N1297: length 7.8
  Bottom Layer w0.254: 49.92,5.59 52.66,5.59 C16.2 C13.2
$1N1313: length 6.1
  Bottom Layer w0.254: C16.1 54.41,1.97 C14.1 52.97,3.41 R6.1
$1N1314: length 13.4
  Bottom Layer w0.254: R5.1 44.15,3.41 C11.2 42.7,1.97 C9.1 41.57,2.63 39.75,2.63 39.24,3.14 39.24,4.44 41.02,6.21
$1N1748: length 3.2
  Bottom Layer w0.203: C18.2 43.11,23.13 41.8,21.82 U5.20
$1N1755: length 2.1
  Bottom Layer w0.203: C21.2 41.26,15.19 42.3,16.22 U5.10
$1N1757: length 1.8
  Bottom Layer w0.203: R9.2 42.8,15.46 U5.9
$1N5710: length 9.9
  Top Layer w0.203: U2.13 17.73,14.24 16.76,15.2 v1(16.76,15.97)
  Bottom Layer w0.203: v1(18.48,22.1) 17.65,21.27 17.65,16.85 v1(16.76,15.97)

## Copper pours and planes (outline as drawn; the poured copper is in the pictures)
+5V on Top Layer: 8.51,19.38 11.56,19.38 11.56,14.7 8.51,14.7
GND1 on Top Layer: 0,26 29.97,26 29.97,0 0,0
GND1 on Bottom Layer: 0,26 29.97,26 29.97,0 0,0

## Text on the board
Bottom Silkscreen Layer: SWDIO | SWCLK | GND | 3.3V | MasterSword_v1.0
Top Silkscreen Layer: VCC | GND | DATA | MasterSword_v1.0
